# Altium project BS.PrjPCB
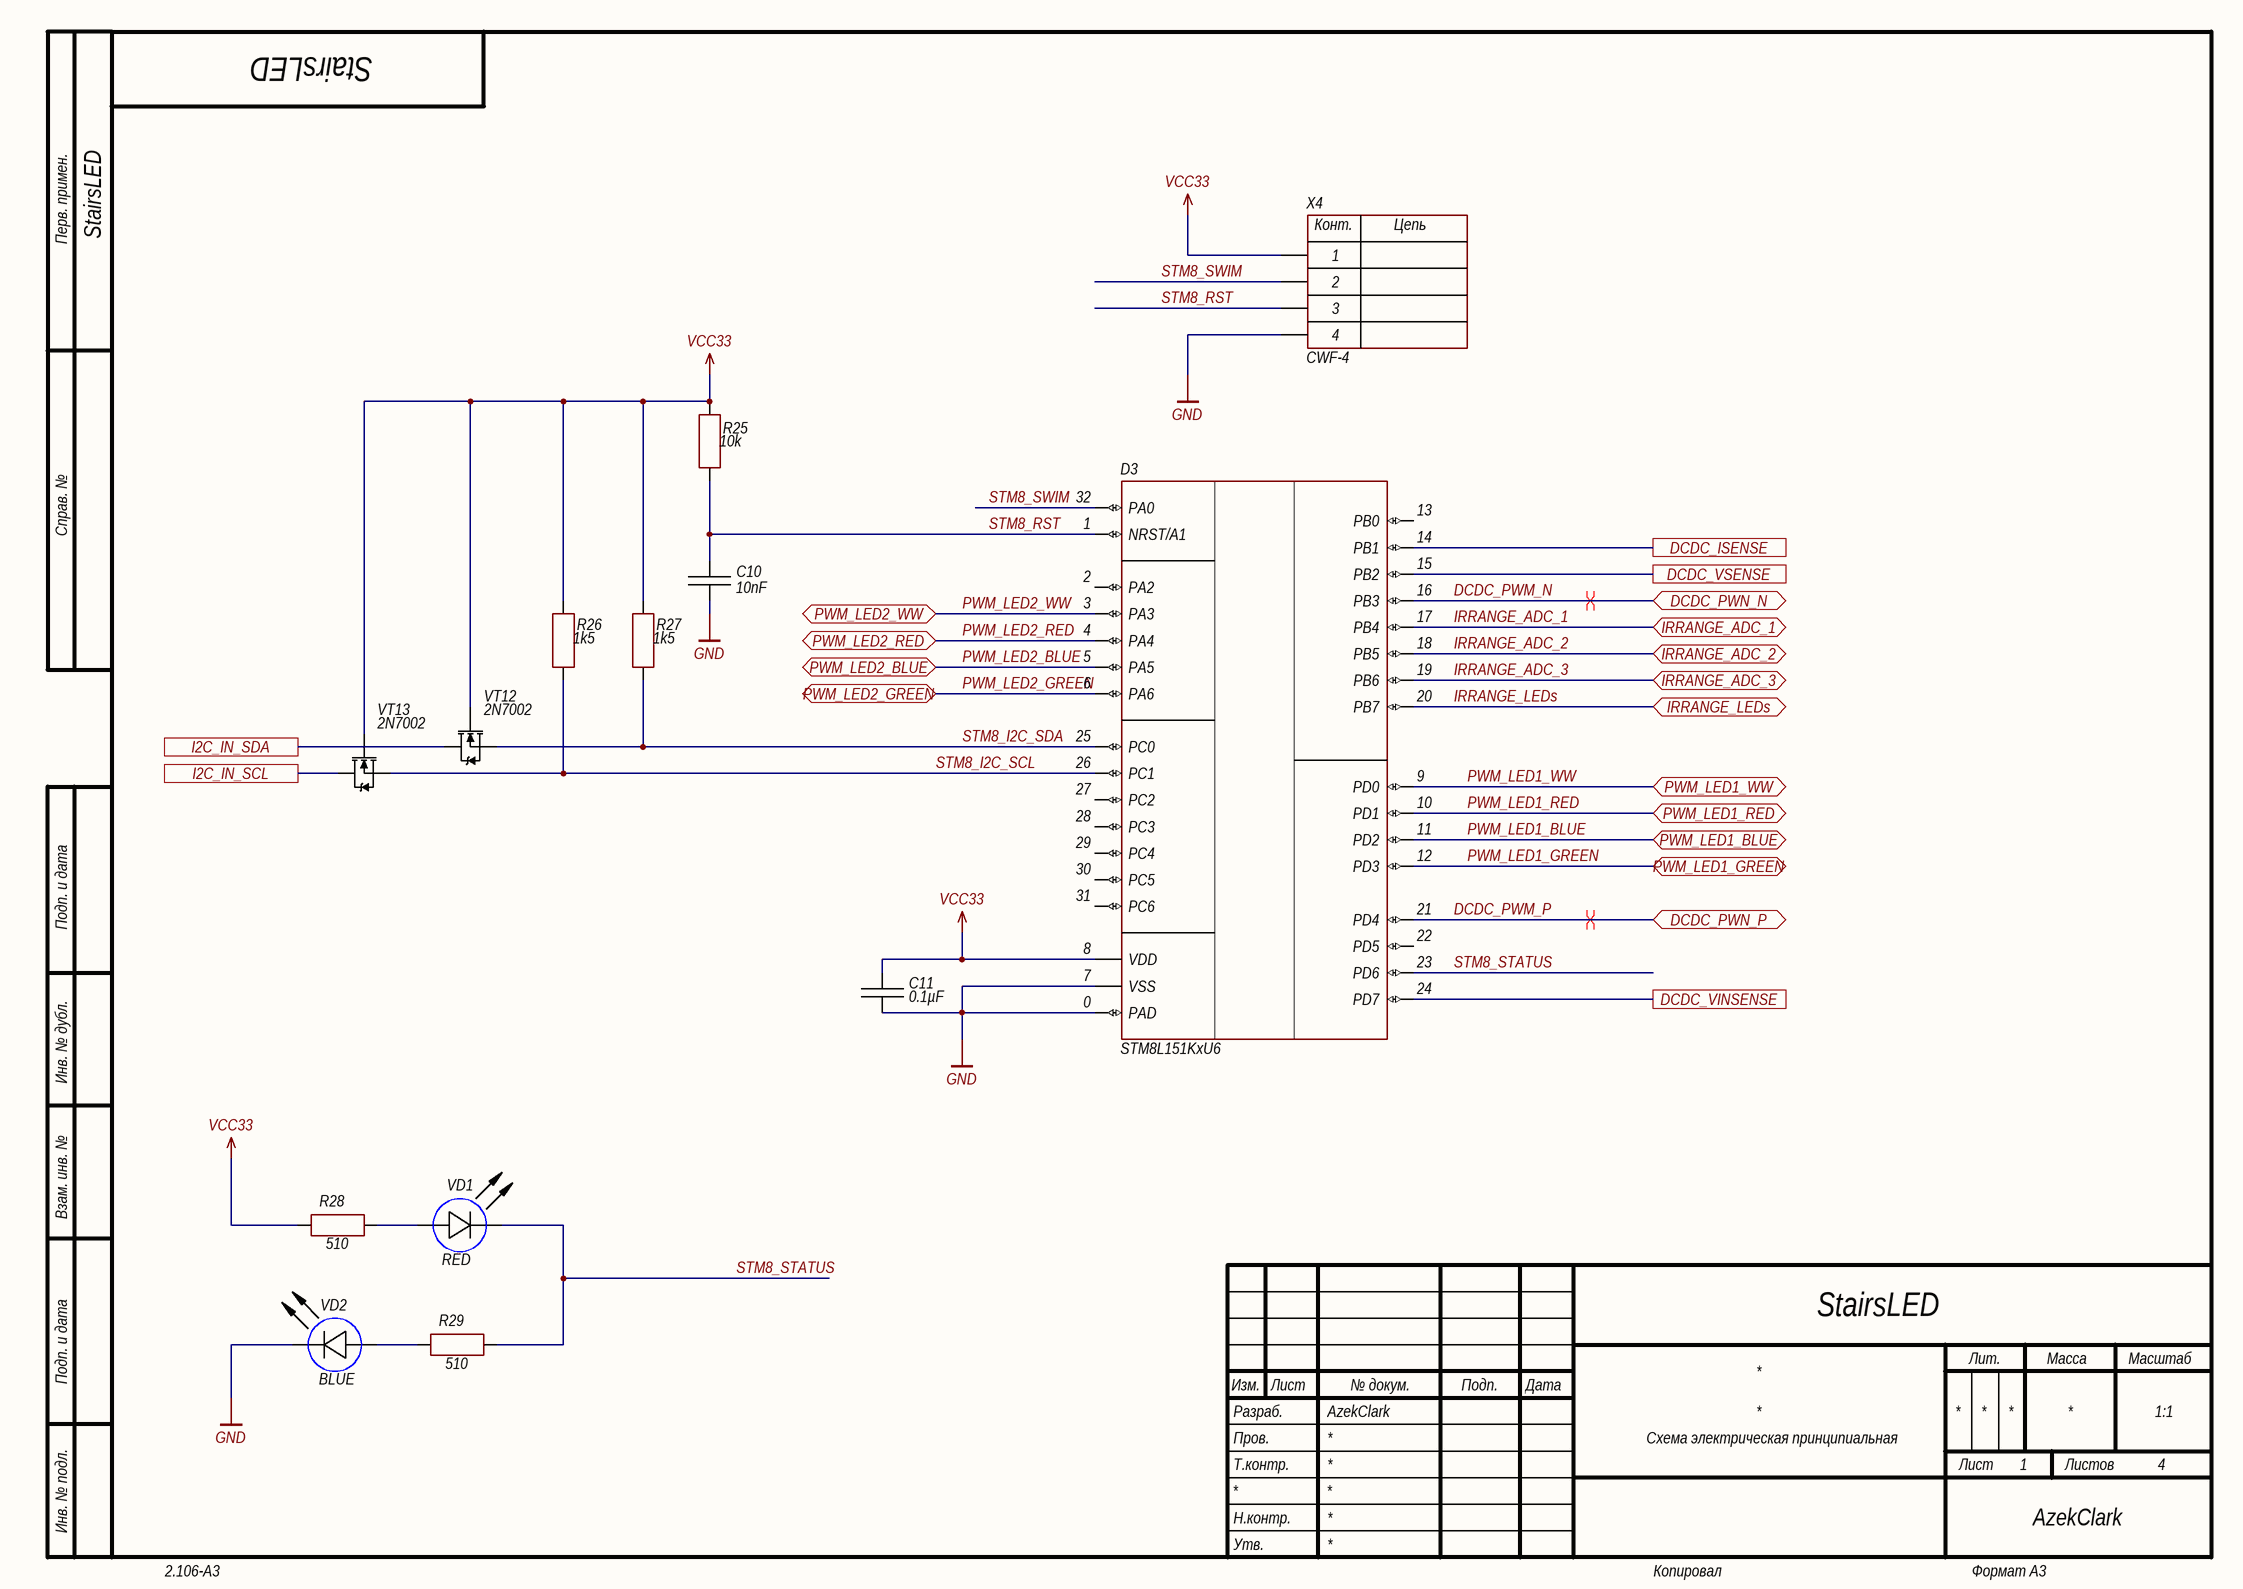
[diagram p0: MCU.SchDoc]
4 sheets, 82 parts. Net scope: flat (ports and power ports of the same name join across sheets).
Board file: PCB.PcbDoc
Sheets:
  MCU.SchDoc
  Power.SchDoc
  LED Connection.SchDoc
  IR Range.SchDoc

## Sheet MCU.SchDoc
size 420 x 297 mm; Author: AzekClark; CompanyName: AzekClark; Address1: Address1; Address2: Address2; Address3: Address3; Address4: Address4; DocumentNumber: StairsLED; SheetNumber: 1; SheetTotal: 4; Scale: 1:1; DocumentType: Схема электрическая принципиальная; FirstReferrence: StairsLED

### Parts
C10  10nF  [CH0603C]
C11  0.1µF  [CH0603C]
D3  STM8L151KxU6  [32-UFQFPN]
R25  10k  [CH0603R]
R26  1k5  [CH0603R]
R27  1k5  [CH0603R]
R28  510  [CH0603R]
R29  510  [CH0603R]
VD1  RED  [CH0603LR]
VD2  BLUE  [CH0603LB]
VT12  2N7002  [SOT23_132]
VT13  2N7002  [SOT23_132]
X4  CWF-4  [CON: CWF-4]

### Ports
DCDC_ISENSE, DCDC_PWN_N (bidir), DCDC_PWN_P (bidir), DCDC_VINSENSE, DCDC_VSENSE, I2C_IN_SCL, I2C_IN_SDA, IRRANGE_ADC_1 (bidir), IRRANGE_ADC_2 (bidir), IRRANGE_ADC_3 (bidir), IRRANGE_LEDs (bidir), PWM_LED1_BLUE (bidir), PWM_LED1_GREEN (bidir), PWM_LED1_RED (bidir), PWM_LED1_WW (bidir), PWM_LED2_BLUE (bidir), PWM_LED2_GREEN (bidir), PWM_LED2_RED (bidir), PWM_LED2_WW (bidir)

### Nets
GND: C10.1 C11.2 D3.0(PAD) D3.7(VSS) VD2.2(C) X4.4
VCC33: C11.1 D3.8(VDD) R25.2 R26.2 R27.2 R28.2 VT12.1(G) VT13.1(G) X4.1
DCDC_ADC_VFB: D3.15(PB2) ; port DCDC_VSENSE
DCDC_ISENSE: D3.14(PB1) ; port DCDC_ISENSE
DCDC_PWM_N: D3.16(PB3) ; port DCDC_PWN_N
DCDC_PWM_P: D3.21(PD4) ; port DCDC_PWN_P
DCDC_VINSENSE: D3.24(PD7) ; port DCDC_VINSENSE
I2C_IN_SCL: VT13.2(D) ; port I2C_IN_SCL
I2C_IN_SDA: VT12.2(D) ; port I2C_IN_SDA
IRRANGE_ADC_1: D3.17(PB4) ; port IRRANGE_ADC_1
IRRANGE_ADC_2: D3.18(PB5) ; port IRRANGE_ADC_2
IRRANGE_ADC_3: D3.19(PB6) ; port IRRANGE_ADC_3
IRRANGE_LEDs: D3.20(PB7) ; port IRRANGE_LEDs
PWM_LED1_BLUE: D3.11(PD2) ; port PWM_LED1_BLUE
PWM_LED1_GREEN: D3.12(PD3) ; port PWM_LED1_GREEN
PWM_LED1_RED: D3.10(PD1) ; port PWM_LED1_RED
PWM_LED1_WW: D3.9(PD0) ; port PWM_LED1_WW
PWM_LED2_BLUE: D3.5(PA5) ; port PWM_LED2_BLUE
PWM_LED2_GREEN: D3.6(PA6) ; port PWM_LED2_GREEN
PWM_LED2_RED: D3.4(PA4) ; port PWM_LED2_RED
PWM_LED2_WW: D3.3(PA3) ; port PWM_LED2_WW
STM8_I2C_SCL: D3.26(PC1) R26.1 VT13.3(S)
STM8_I2C_SDA: D3.25(PC0) R27.1 VT12.3(S)
STM8_RST: C10.2 D3.1(NRST/A1) R25.1 X4.3
STM8_STATUS: D3.23(PD6) R29.1 VD1.2(C)
STM8_SWIM: D3.32(PA0) X4.2
NetR28_1: R28.1 VD1.1(A)
NetR29_2: R29.2 VD2.1(A)

Not connected (* = marked no-connect by the designer): D3 2(PA2) 13(PB0) 22(PD5) 27(PC2) 28(PC3) 29(PC4) 30(PC5) 31(PC6)

### Layout directives
differential pair: DCDC_PWM_N, DCDC_PWM_P

### Notes on the sheet
- Перв. примен.
- Справ. №
- Подп. и дата
- Инв. № дубл.
- Взам. инв. №
- Разраб.
- Изм.
- Лист
- № докум.
- Подп.
- Дата
- Лит.
- Масса
- Масштаб
- Пров.
- Т.контр.
- Листов
- Инв. № подл.
- Утв.
- Н.контр.
- 2.106-A3
- Копировал
- Формат А3

### Library data of the parts
C10 C11 = Capacitor: Manufacturer: *; Model: *; HelpURL: *; ComponentKind: *
  C10: Value: 10nF
  C11: Value: 0.1µF
D3 = STM8L151KxU6: STM8; Manufacturer: ST Microelectronics; Model: STM8L151GxU6; ComponentKind: UFQFPN28; HelpURL: https://ru.mouser.com/datasheet/2/389/stm8l151c4-956418.pdf
R25-R29 = Resistor: Manufacturer: *; Model: *; HelpURL: *; ComponentKind: *
  R25: Value: 10k
  R26 R27: Value: 1k5
  R28 R29: Value: 510
VD1 VD2 = LED: Manufacturer: *; Model: *; HelpURL: *; ComponentKind: *
  VD1: Value: RED
  VD2: Value: BLUE
VT12 VT13 = N-chanel: Mosfet; Manufacturer: ON Semiconductor; Model: 2N7002; ComponentKind: 0.2А, 60В; HelpURL: https://static.chipdip.ru/lib/318/DOC000318735.pdf
X4 = 4-Connector: Model: CWF-4; Manufacturer: *; HelpURL: *; ComponentKind: *

## Sheet Power.SchDoc
size 420 x 297 mm; Author: AzekClark; CompanyName: AzekClark; Address1: Address1; Address2: Address2; Address3: Address3; Address4: Address4; DocumentNumber: StairsLED; SheetNumber: 2; SheetTotal: 4; Scale: 1:1; EngineerName: AzekClark; DocumentType: Схема электрическая принципиальная; FirstReferrence: StairsLED
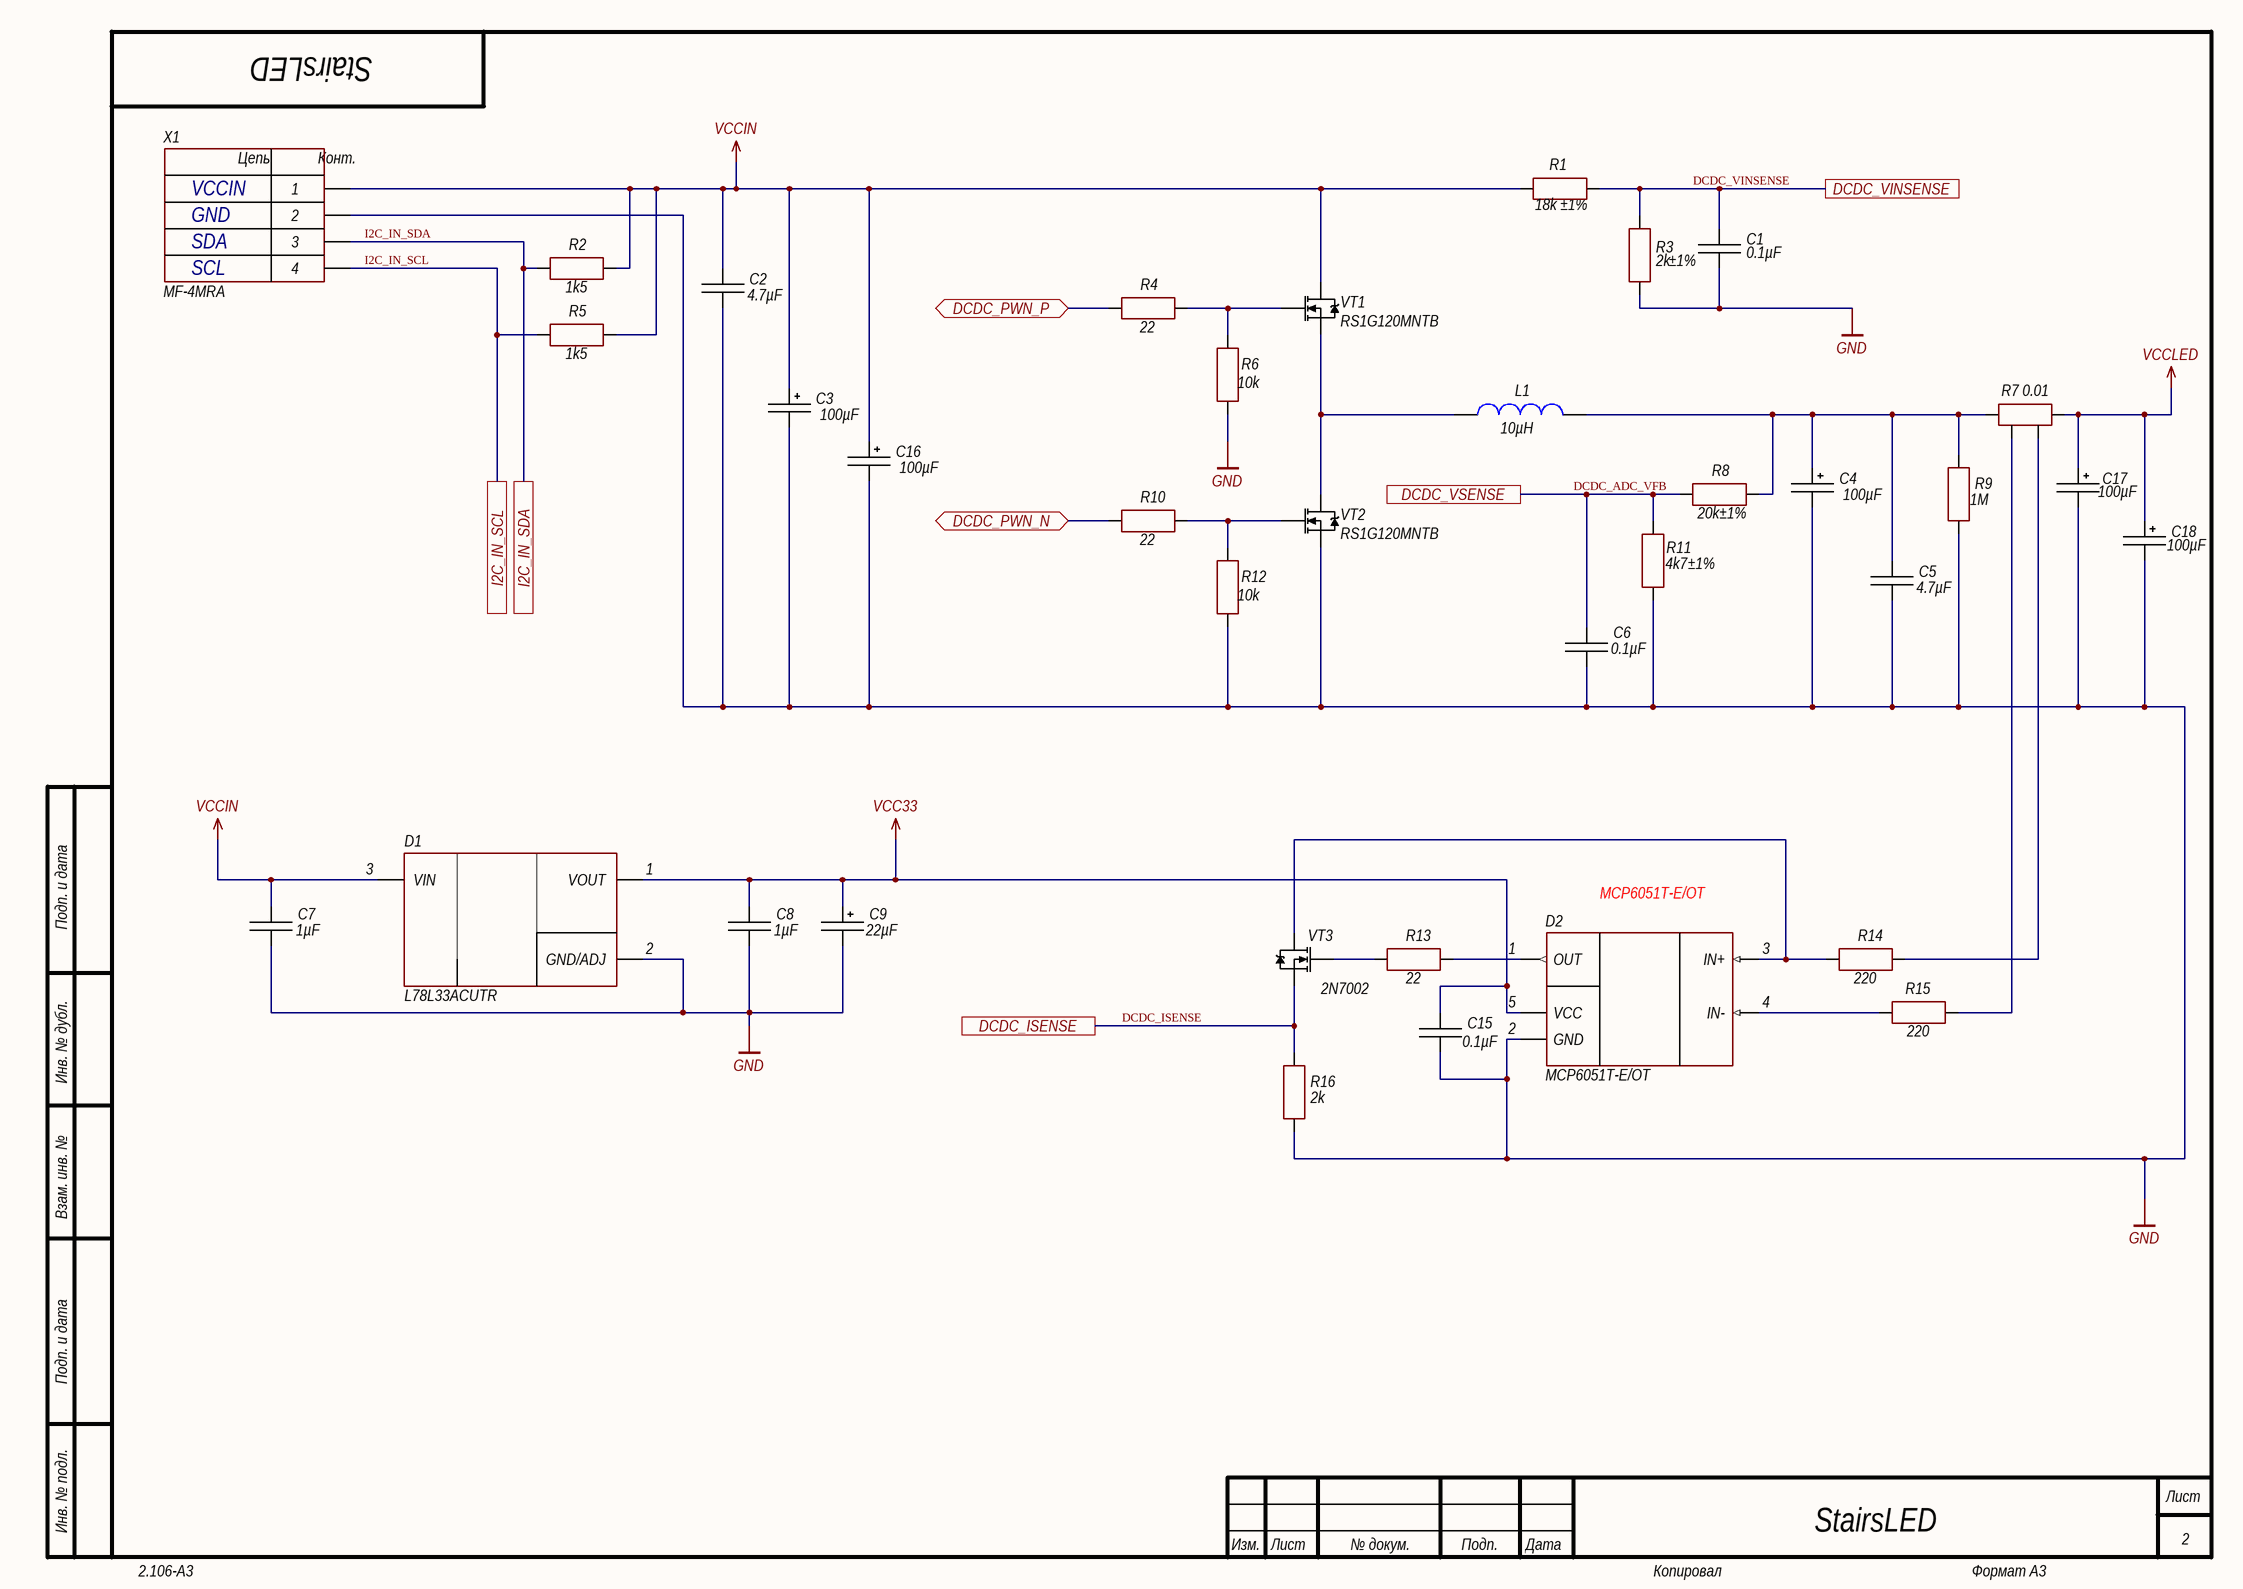
[diagram p1: Power.SchDoc]

### Parts
C1  0.1µF  [CH0603C]
C2  4.7µF  [CH1206C]
C3  100µF  [D6.3C2.5H11]
C4  100µF  [D6.3C2.5H11]
C5  4.7µF  [CH1206C]
C6  0.1µF  [CH0603C]
C7  1µF  [CH0603C]
C8  1µF  [CH0603C]
C9  22µF  [TANTAL_B]
C15  0.1µF  [CH0603C]
C16  100µF  [D6.3C2.5H11]
C17  100µF  [D6.3C2.5H11]
C18  100µF  [D6.3C2.5H11]
D1  L78L33ACUTR  [SOT89_123]
D2  MCP6051T-E/OT  [SOT23-5]
L1  10µH  [IND: CDRH127]
R1  18k  ComponentKind: ±1%  [CH0603R]
R2  1k5  [CH0603R]
R3  2k  ComponentKind: ±1%  [CH0603R]
R4  22  [CH0603R]
R5  1k5  [CH0603R]
R6  10k  [CH0603R]
R7  0.01  [SHNT: CRA2512]
R8  20k  ComponentKind: ±1%  [CH0603R]
R9  1M  [CH1206R]
R10  22  [CH0603R]
R11  4k7  ComponentKind: ±1%  [CH0603R]
R12  10k  [CH0603R]
R13  22  [CH0603R]
R14  220  [CH0603R]
R15  220  [CH0603R]
R16  2k  [CH0603R]
VT1  RS1G120MNTB  [8-TDSON]
VT2  RS1G120MNTB  [8-TDSON]
VT3  2N7002  [SOT23_132]
X1  MF-4MRA  [CON: MF-4MRA]

### Ports
DCDC_ISENSE, DCDC_PWN_N (bidir), DCDC_PWN_P (bidir), DCDC_VINSENSE, DCDC_VSENSE, I2C_IN_SCL, I2C_IN_SDA

### Nets
GND: C1.2 C2.1 C3.2 C4.2 C5.1 C6.2 C7.1 C8.1 C9.2 C15.1 C16.2 C17.2 C18.2 D1.2(GND/ADJ) D2.2(GND) R3.1 R6.1 R9.1 R11.1 R12.1 R16.1 VT2.3(S) X1.2
VCC33: C8.2 C9.1 C15.2 D1.1(VOUT) D2.5(VCC)
VCCIN: C2.2 C3.1 C7.2 C16.1 D1.3(VIN) R1.2 R2.2 R5.2 VT1.2(D) X1.1
VCCLED: C17.1 C18.1 R7.2
DCDC_ADC_VFB: C6.1 R8.1 R11.2 ; port DCDC_VSENSE
DCDC_ISENSE: R16.2 VT3.3(S) ; port DCDC_ISENSE
DCDC_PWM_N: R10.1 ; port DCDC_PWN_N
DCDC_PWM_P: R4.1 ; port DCDC_PWN_P
DCDC_VINSENSE: C1.1 R1.1 R3.2 ; port DCDC_VINSENSE
I2C_IN_SCL: R5.1 X1.4 ; port I2C_IN_SCL
I2C_IN_SDA: R2.1 X1.3 ; port I2C_IN_SDA
NetC4_1: C4.1 C5.2 L1.1 R7.1 R8.2 R9.2
NetD2_1: D2.1(OUT) R13.2
NetD2_3: D2.3(IN+) R14.1 VT3.2(D)
NetD2_4: D2.4(IN-) R15.1
NetL1_2: L1.2 VT1.3(S) VT2.2(D)
NetR4_2: R4.2 R6.2 VT1.1(G)
NetR7_3: R7.3 R15.2
NetR7_4: R7.4 R14.2
NetR10_2: R10.2 R12.2 VT2.1(G)
NetR13_1: R13.1 VT3.1(G)

### Notes on the sheet
- VCCIN
- SDA
- GND
- SCL
- MCP6051T-E/OT
- Подп. и дата
- Инв. № дубл.
- Взам. инв. №
- Инв. № подл.
- Изм.
- Лист
- № докум.
- Подп.
- Дата
- 2.106-A3
- Копировал
- Формат А3
- (in symbol 4-Connector) Цепь; Конт.

### Library data of the parts
C1 C6 C15 = Capacitor: Manufacturer: *; Model: *; HelpURL: *; ComponentKind: *; Value: 0.1µF
C2 C5 = Capacitor: Manufacturer: Murata; Model: GRM31CR71H475KA12; HelpURL: https://www.chipdip.ru/product/grm31cr71h475ka12l; ComponentKind: 50V, X7R; Value: 4.7µF
C3 C4 C16-C18 = AlumCap: Manufacturer: BURNON; Model: -; HelpURL: https://www.chipdip.ru/product0/8001594426; ComponentKind: 35V; Value: 100µF
C7 C8 = Capacitor: Manufacturer: Murata Electronics Inc.; Model: GRM188R71C105KE15D; HelpURL: https://www.terraelectronica.ru/product/2094261; ComponentKind: X5R; Value: 1µF
C9 = TantalCap: Manufacturer: *; Model: *; HelpURL: *; ComponentKind: *; Value: 22µF
D1 = L78LxxACUTR: Step-down; Manufacturer: ST Microelectronics; Model: L78L33ACUTR; HelpURL: https://www.st.com/resource/en/datasheet/l78l.pdf; ComponentKind: SOT-89, 100mA
D2 = MCP6001T: OP amplifier; Manufacturer: Microchip Technology; Model: MCP6051T-E/OT; HelpURL: https://www.digikey.com/product-detail/en/microchip-technology/MCP6001T-I-OT/MCP6001T-I-OTCT-ND/697158; ComponentKind: SOT23-5
L1 = Inductor: Manufacturer: Sumida Electric; Model: SCDS127T-100M-N; HelpURL: https://www.chipdip.ru/product0/9000523882; ComponentKind: 5.4A; Value: 10µH
R1-R6 R8-R16 = Resistor: Manufacturer: *; Model: *; HelpURL: *
  R1: Value: 18k
  R2 R5: ComponentKind: *; Value: 1k5
  R3: Value: 2k
  R4 R10 R13: ComponentKind: *; Value: 22
  R6 R12: ComponentKind: *; Value: 10k
  R8: Value: 20k
  R9: ComponentKind: *; Value: 1M
  R11: Value: 4k7
  R14 R15: ComponentKind: *; Value: 220
  R16: ComponentKind: *; Value: 2k
R7 = Shunt: Manufacturer: Bourns; Model: CRA2512-FZ-R010ELF; HelpURL: https://static6.arrow.com/aropdfconversion/58bb460c8d6e9e02f20276cbc5e1de2f00a5855b/815cra.pdf; ComponentKind: 3W; Value: 0.01
VT1 VT2 = N-chanel: Mosfet; Manufacturer: Rohm; Model: RS1G120MNTB; ComponentKind: 40V, 13A, 61mOm; HelpURL: https://www.rohm.com/datasheet/RQ3L050GN/rq3l050gntb-e
VT3 = N-chanel: Mosfet; Manufacturer: ON Semiconductor; Model: 2N7002; ComponentKind: 0.2А, 60В; HelpURL: https://static.chipdip.ru/lib/318/DOC000318735.pdf
X1 = 4-Connector: Model: MF-4MRA; Manufacturer: *; HelpURL: *; ComponentKind: *

## Sheet LED Connection.SchDoc
size 420 x 297 mm; Address1: Address1; Address2: Address2; Address3: Address3; Address4: Address4; DocumentNumber: StairsLED; SheetNumber: 3; Scale: 1:1; DocumentType: Схема электрическая принципиальная; FirstReferrence: StaitsLED
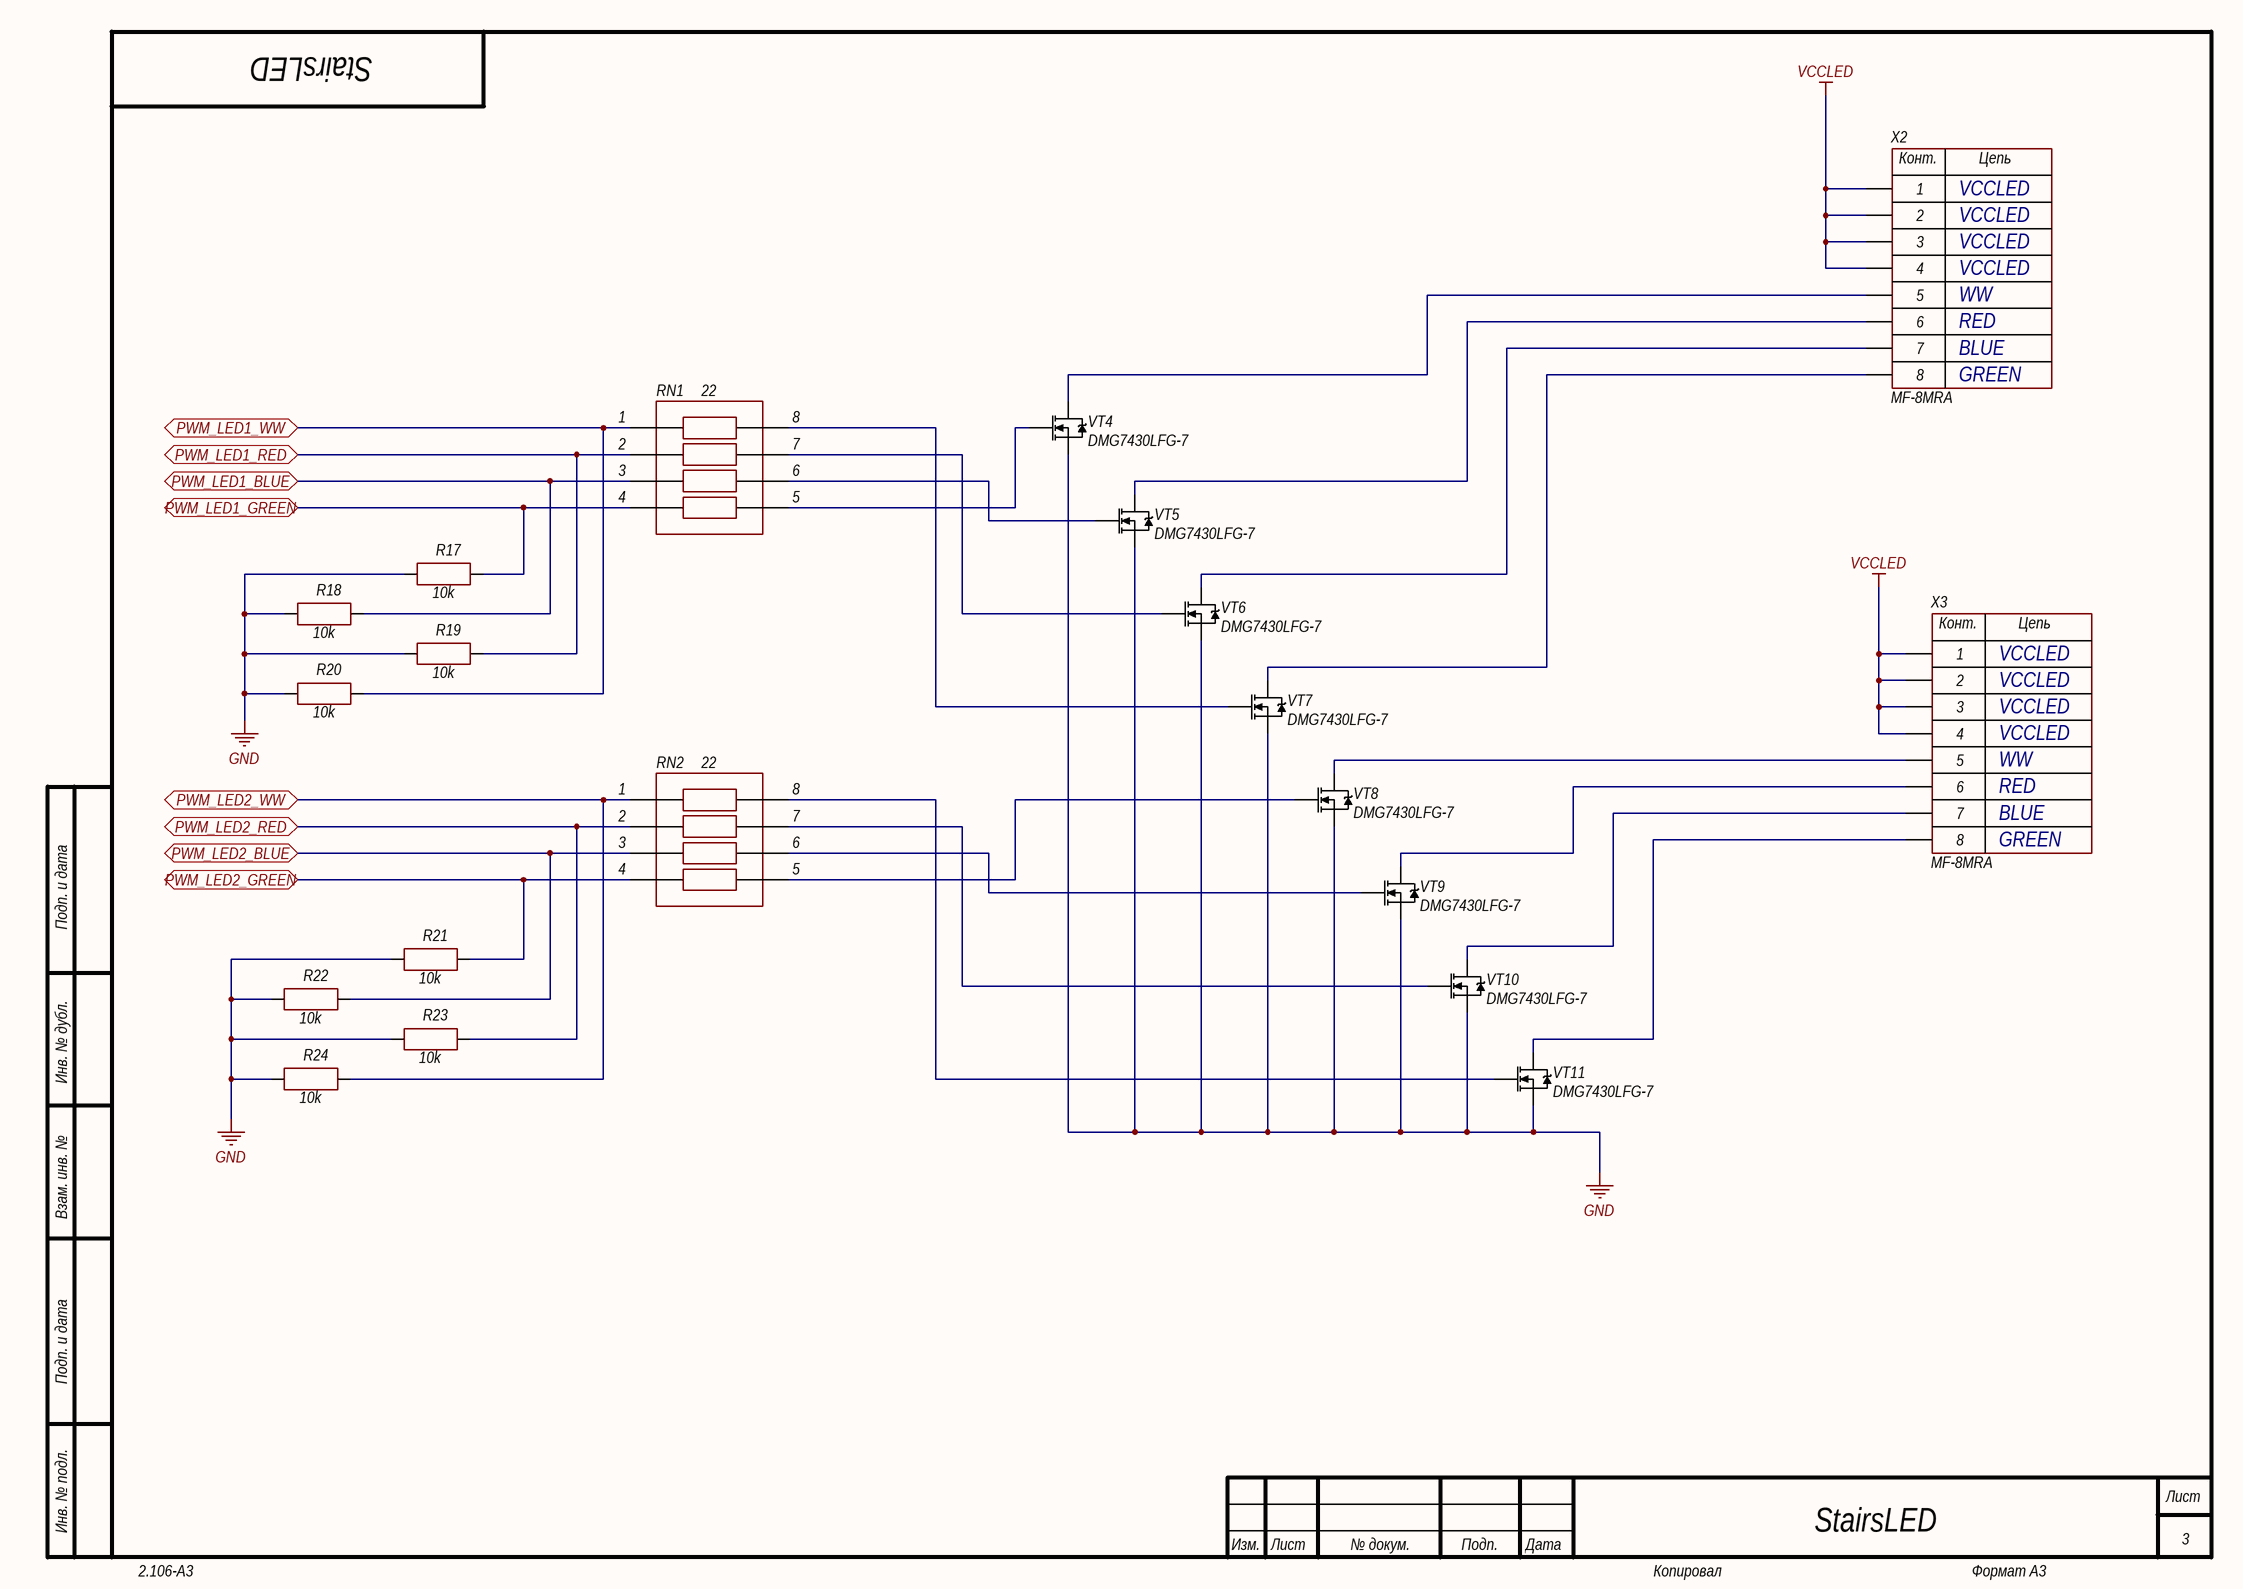
[diagram p2: LED Connection.SchDoc]

### Parts
R17  10k  [CH0603R]
R18  10k  [CH0603R]
R19  10k  [CH0603R]
R20  10k  [CH0603R]
R21  10k  [CH0603R]
R22  10k  [CH0603R]
R23  10k  [CH0603R]
R24  10k  [CH0603R]
RN1  22  [CH0603Rx4 (1206)]
RN2  22  [CH0603Rx4 (1206)]
VT4  DMG7430LFG-7  [TRANS: PowerDI®3333-8]
VT5  DMG7430LFG-7  [TRANS: PowerDI®3333-8]
VT6  DMG7430LFG-7  [TRANS: PowerDI®3333-8]
VT7  DMG7430LFG-7  [TRANS: PowerDI®3333-8]
VT8  DMG7430LFG-7  [TRANS: PowerDI®3333-8]
VT9  DMG7430LFG-7  [TRANS: PowerDI®3333-8]
VT10  DMG7430LFG-7  [TRANS: PowerDI®3333-8]
VT11  DMG7430LFG-7  [TRANS: PowerDI®3333-8]
X2  MF-8MRA  [CON: MF-8MRA]
X3  MF-8MRA  [CON: MF-8MRA]

### Ports
PWM_LED1_BLUE (bidir), PWM_LED1_GREEN (bidir), PWM_LED1_RED (bidir), PWM_LED1_WW (bidir), PWM_LED2_BLUE (bidir), PWM_LED2_GREEN (bidir), PWM_LED2_RED (bidir), PWM_LED2_WW (bidir)

### Nets
GND: R17.1 R18.1 R19.1 R20.1 R21.1 R22.1 R23.1 R24.1 VT4.3(S) VT5.3(S) VT6.3(S) VT7.3(S) VT8.3(S) VT9.3(S) VT10.3(S) VT11.3(S)
VCCLED: X2.1 X2.2 X2.3 X2.4 X3.1 X3.2 X3.3 X3.4
PWM_LED1_BLUE: R18.2 RN1.3 ; port PWM_LED1_BLUE
PWM_LED1_GREEN: R17.2 RN1.4 ; port PWM_LED1_GREEN
PWM_LED1_RED: R19.2 RN1.2 ; port PWM_LED1_RED
PWM_LED1_WW: R20.2 RN1.1 ; port PWM_LED1_WW
PWM_LED2_BLUE: R22.2 RN2.3 ; port PWM_LED2_BLUE
PWM_LED2_GREEN: R21.2 RN2.4 ; port PWM_LED2_GREEN
PWM_LED2_RED: R23.2 RN2.2 ; port PWM_LED2_RED
PWM_LED2_WW: R24.2 RN2.1 ; port PWM_LED2_WW
NetRN1_5: RN1.5 VT4.1(G)
NetRN1_6: RN1.6 VT5.1(G)
NetRN1_7: RN1.7 VT6.1(G)
NetRN1_8: RN1.8 VT7.1(G)
NetRN2_5: RN2.5 VT8.1(G)
NetRN2_6: RN2.6 VT9.1(G)
NetRN2_7: RN2.7 VT10.1(G)
NetRN2_8: RN2.8 VT11.1(G)
NetVT4_2: VT4.2(D) X2.5
NetVT5_2: VT5.2(D) X2.6
NetVT6_2: VT6.2(D) X2.7
NetVT7_2: VT7.2(D) X2.8
NetVT8_2: VT8.2(D) X3.5
NetVT9_2: VT9.2(D) X3.6
NetVT10_2: VT10.2(D) X3.7
NetVT11_2: VT11.2(D) X3.8

### Notes on the sheet
- VCCLED
- WW
- RED
- BLUE
- GREEN
- Подп. и дата
- Инв. № дубл.
- Взам. инв. №
- Инв. № подл.
- Изм.
- Лист
- № докум.
- Подп.
- Дата
- 2.106-A3
- Копировал
- Формат А3
- (in symbol 8-Connector) Конт.; Цепь

### Library data of the parts
R17-R24 = Resistor: Manufacturer: *; Model: *; HelpURL: *; ComponentKind: *; Value: 10k
RN1 RN2 = Resistor assembly: Manufacturer: Bourns GmbH.; Model: CAT16-J4; HelpURL: https://www.terraelectronica.ru/pdf/show?pdf_file=https%253A%252F%252Fwww.mouser.com%252Fds%252F2%252F54%252FATCAY-777361.pdf; ComponentKind: *; Value: 22
VT4-VT11 = N-chanel: Mosfet; Manufacturer: Diodes Incorporated; Model: DMG7430LFG-7; ComponentKind: 30V, 10A; HelpURL: https://www.diodes.com/assets/Datasheets/DMG7430LFG.pdf
X2 X3 = 8-Connector: Model: MF-8MRA; Manufacturer: *; HelpURL: *; ComponentKind: *

## Sheet IR Range.SchDoc
size 420 x 297 mm; Organization: AzekClark; DocumentNumber: StairsLED; SheetNumber: 4; Scale: 1:1; DocumentType: Схема электрическая принципиальная; FirstReferrence: StairsLED
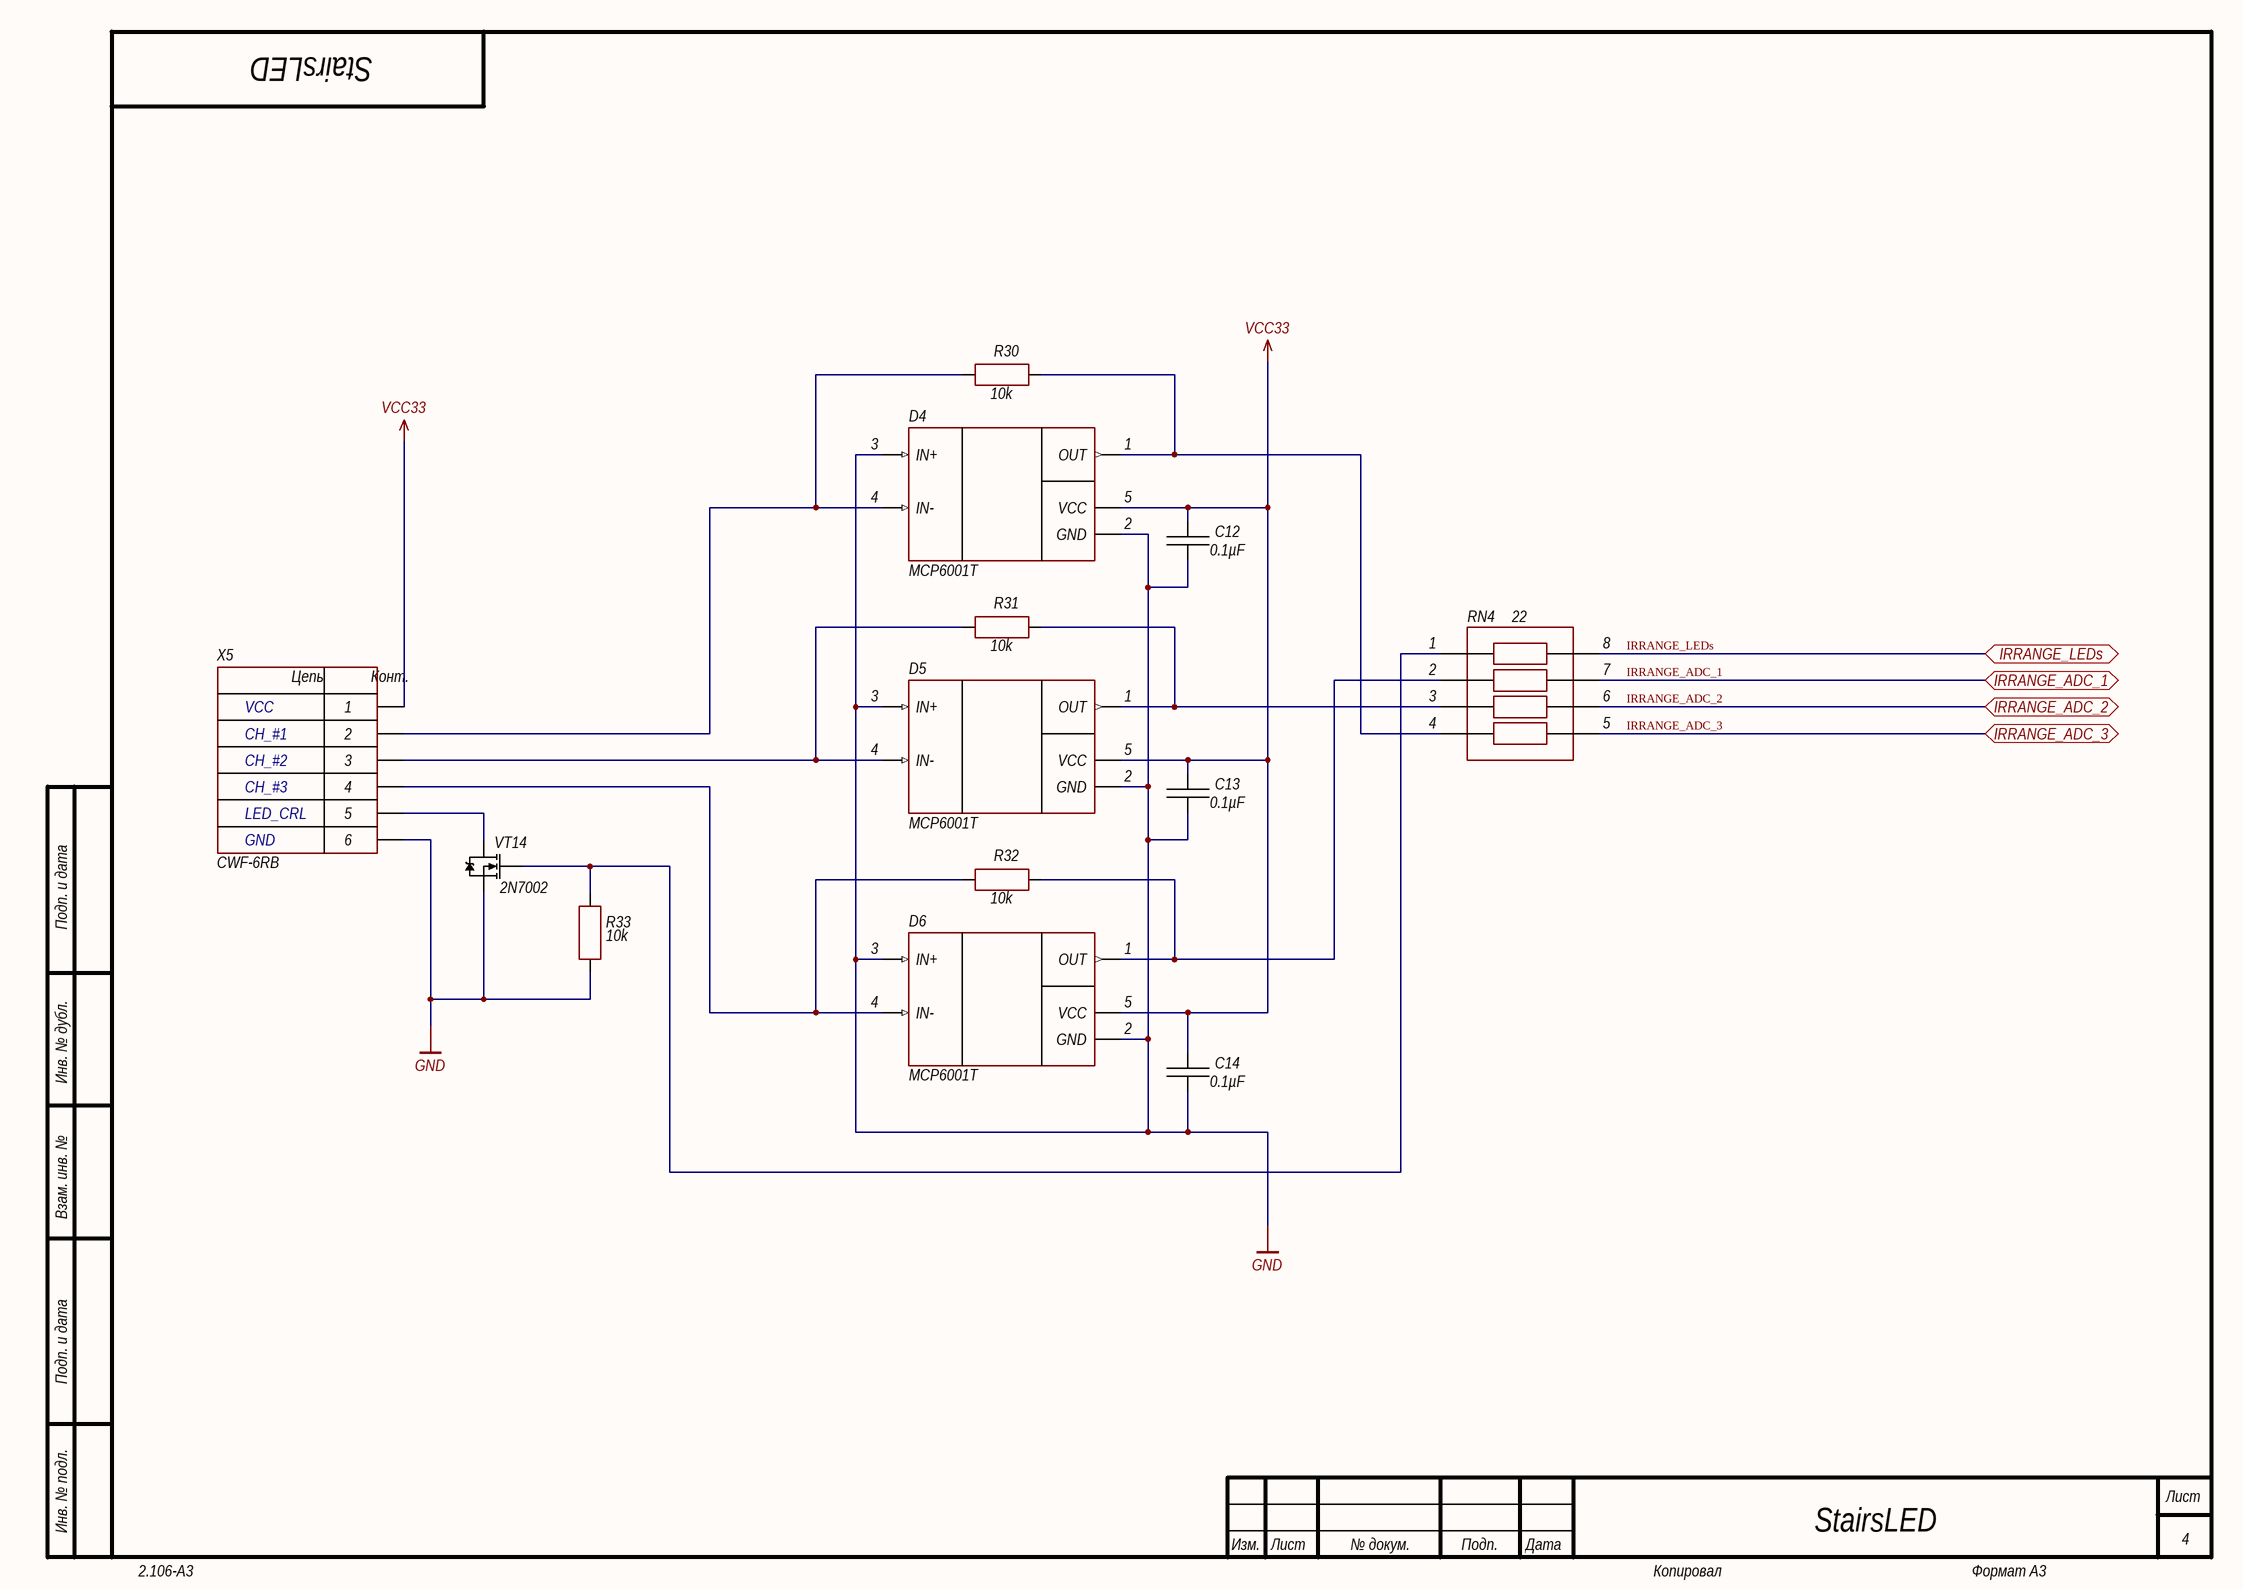
[diagram p3: IR Range.SchDoc]

### Parts
C12  0.1µF  [CH0603C]
C13  0.1µF  [CH0603C]
C14  0.1µF  [CH0603C]
D4  MCP6001T  [SOT23-5]
D5  MCP6001T  [SOT23-5]
D6  MCP6001T  [SOT23-5]
R30  10k  [CH0603R]
R31  10k  [CH0603R]
R32  10k  [CH0603R]
R33  10k  [CH0603R]
RN4  22  [CH0603Rx4 (1206)]
VT14  2N7002  [SOT23_132]
X5  CWF-6RB  [CON: CWF-6RB]

### Ports
IRRANGE_ADC_1 (bidir), IRRANGE_ADC_2 (bidir), IRRANGE_ADC_3 (bidir), IRRANGE_LEDs (bidir)

### Nets
GND: C12.1 C13.1 C14.1 D4.2(GND) D4.3(IN+) D5.2(GND) D5.3(IN+) D6.2(GND) D6.3(IN+) R33.1 VT14.3(S) X5.6
VCC33: C12.2 C13.2 C14.2 D4.5(VCC) D5.5(VCC) D6.5(VCC) X5.1
IRRANGE_ADC_1: RN4.7 ; port IRRANGE_ADC_1
IRRANGE_ADC_2: RN4.6 ; port IRRANGE_ADC_2
IRRANGE_ADC_3: RN4.5 ; port IRRANGE_ADC_3
IRRANGE_LEDs: RN4.8 ; port IRRANGE_LEDs
NetD4_1: D4.1(OUT) R30.2 RN4.4
NetD4_4: D4.4(IN-) R30.1 X5.2
NetD5_1: D5.1(OUT) R31.2 RN4.3
NetD5_4: D5.4(IN-) R31.1 X5.3
NetD6_1: D6.1(OUT) R32.2 RN4.2
NetD6_4: D6.4(IN-) R32.1 X5.4
NetR33_2: R33.2 RN4.1 VT14.1(G)
NetVT14_2: VT14.2(D) X5.5

### Notes on the sheet
- VCC
- CH_#1
- CH_#2
- CH_#3
- GND
- LED_CRL
- Подп. и дата
- Инв. № дубл.
- Взам. инв. №
- Инв. № подл.
- Изм.
- Лист
- № докум.
- Подп.
- Дата
- 2.106-A3
- Копировал
- Формат А3
- (in symbol 6-Connector) Цепь; Конт.

### Library data of the parts
C12-C14 = Capacitor: Manufacturer: *; Model: *; HelpURL: *; ComponentKind: *; Value: 0.1µF
D4-D6 = MCP6001T: OP amplifier; Manufacturer: Microchip Technology; Model: MCP6001T-I/OT; HelpURL: https://www.digikey.com/product-detail/en/microchip-technology/MCP6001T-I-OT/MCP6001T-I-OTCT-ND/697158; ComponentKind: SOT23-5
R30-R33 = Resistor: Manufacturer: *; Model: *; HelpURL: *; ComponentKind: *; Value: 10k
RN4 = Resistor assembly: as RN1 on sheet LED Connection; HelpURL: https://www.terraelectronica.ru/pdf/show?pdf_file=https%253A%252F%252Fwww.mouser.com%252Fds%252F2%252F54%252FATCAY-777361.pdf; ComponentKind: *; Value: 22
VT14 = N-chanel: Mosfet; Manufacturer: ON Semiconductor; Model: 2N7002; ComponentKind: 0.2А, 60В; HelpURL: https://static.chipdip.ru/lib/318/DOC000318735.pdf
X5 = 6-Connector: Model: CWF-6RB; Manufacturer: *; HelpURL: *; ComponentKind: *

## Nets that join several sheets
GND: MCU (6 pins), Power (23 pins), LED Connection (16 pins), IR Range (12 pins)
VCC33: MCU (9 pins), Power (5 pins), IR Range (7 pins)
VCCLED: Power (C17.1 C18.1 R7.2), LED Connection (8 pins)
DCDC_ADC_VFB: MCU (D3.15), Power (C6.1 R8.1 R11.2)
DCDC_ISENSE: MCU (D3.14), Power (R16.2 VT3.3)
DCDC_PWM_N: MCU (D3.16), Power (R10.1)
DCDC_PWM_P: MCU (D3.21), Power (R4.1)
DCDC_VINSENSE: MCU (D3.24), Power (C1.1 R1.1 R3.2)
I2C_IN_SCL: MCU (VT13.2), Power (R5.1 X1.4)
I2C_IN_SDA: MCU (VT12.2), Power (R2.1 X1.3)
IRRANGE_ADC_1: MCU (D3.17), IR Range (RN4.7)
IRRANGE_ADC_2: MCU (D3.18), IR Range (RN4.6)
IRRANGE_ADC_3: MCU (D3.19), IR Range (RN4.5)
IRRANGE_LEDs: MCU (D3.20), IR Range (RN4.8)
PWM_LED1_BLUE: MCU (D3.11), LED Connection (R18.2 RN1.3)
PWM_LED1_GREEN: MCU (D3.12), LED Connection (R17.2 RN1.4)
PWM_LED1_RED: MCU (D3.10), LED Connection (R19.2 RN1.2)
PWM_LED1_WW: MCU (D3.9), LED Connection (R20.2 RN1.1)
PWM_LED2_BLUE: MCU (D3.5), LED Connection (R22.2 RN2.3)
PWM_LED2_GREEN: MCU (D3.6), LED Connection (R21.2 RN2.4)
PWM_LED2_RED: MCU (D3.4), LED Connection (R23.2 RN2.2)
PWM_LED2_WW: MCU (D3.3), LED Connection (R24.2 RN2.1)